# EAGLE design GPIO_Block (EAGLE 6.6.0)

## Sheet 1 of 2
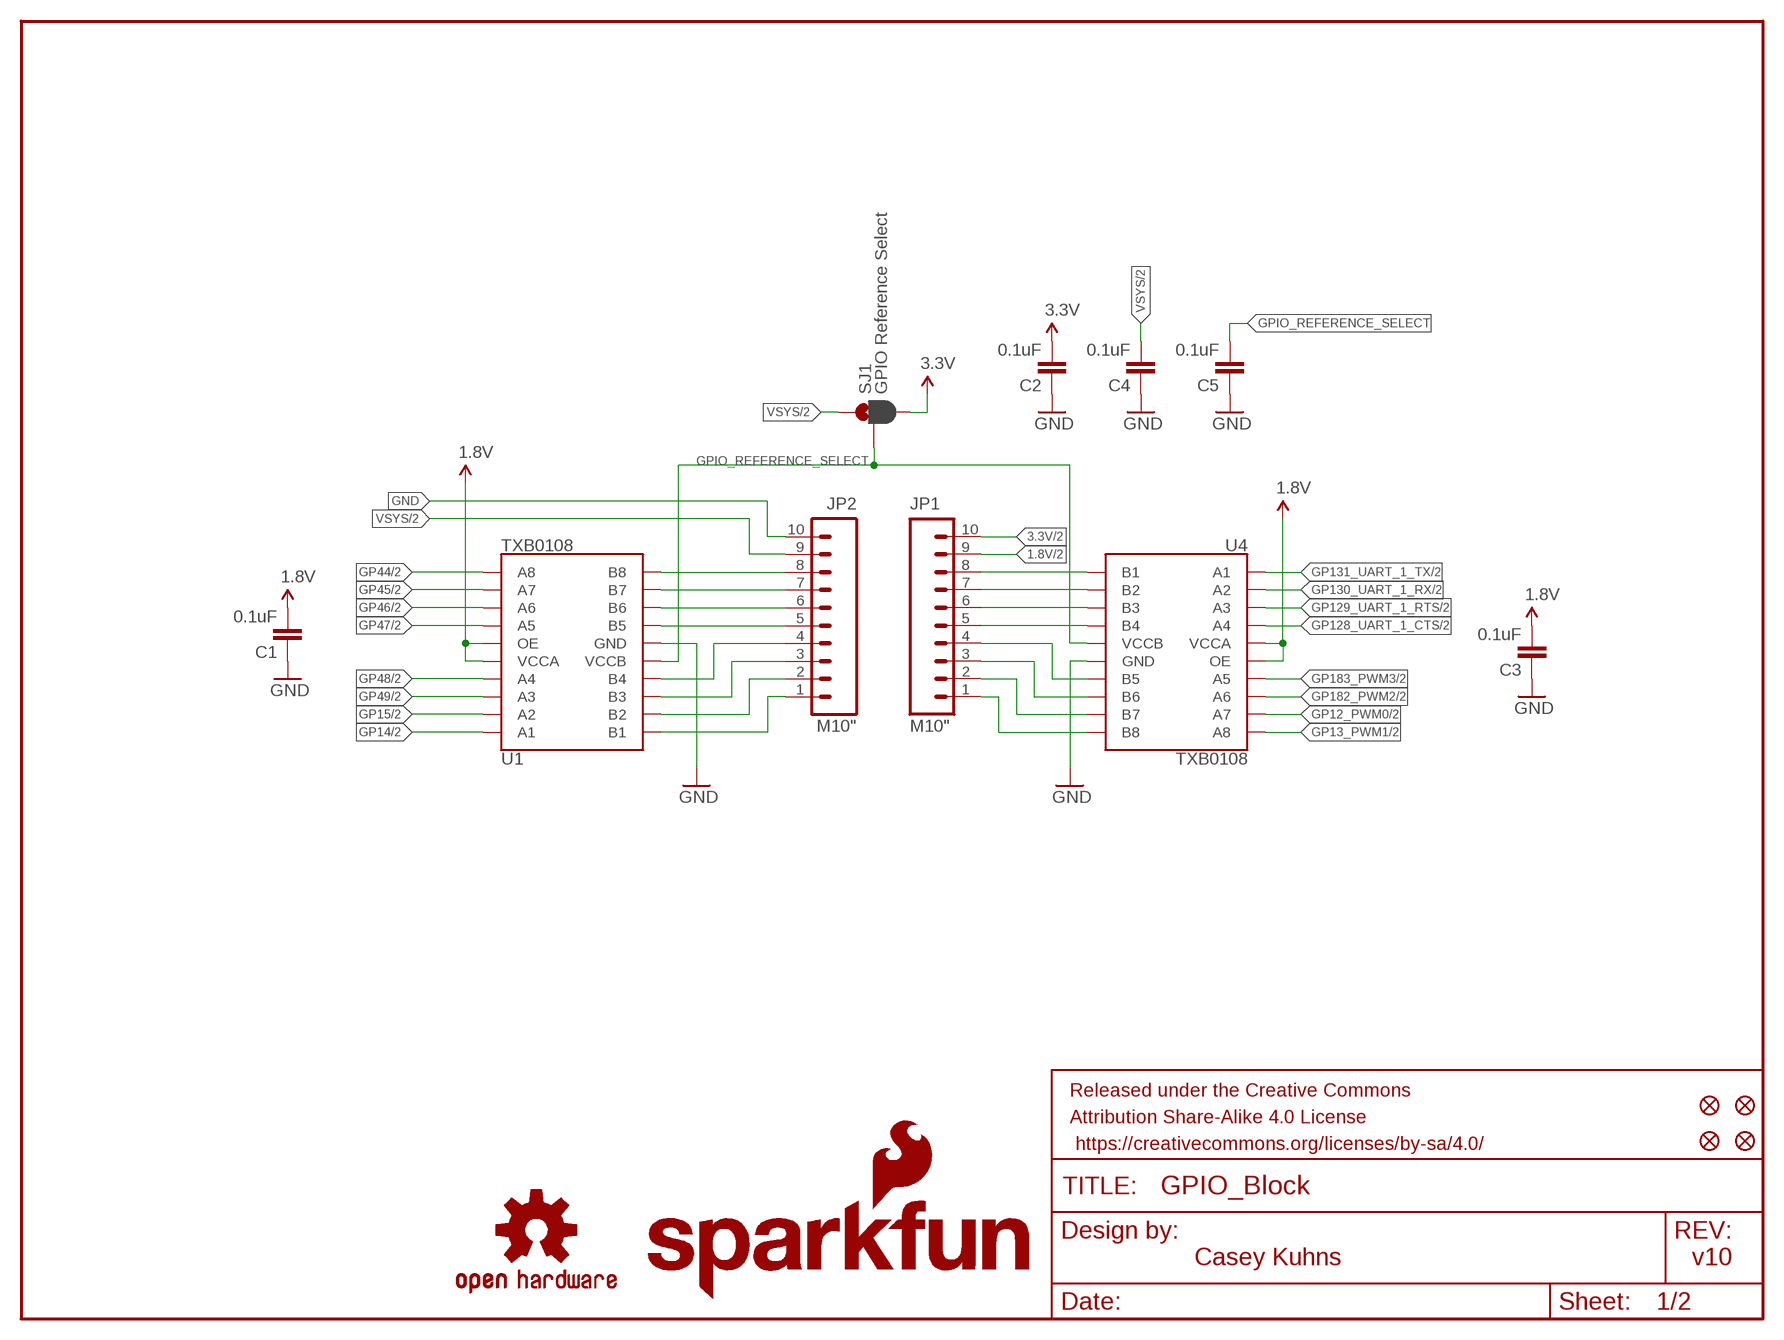
[diagram p0: schematic, sheet 1]

### Parts
C1  0.1uF  0.1UF-25V(+80/-20%)(0603)  [0603-CAP]
C2  0.1uF  0.1UF-25V(+80/-20%)(0603)  [0603-CAP]
C3  0.1uF  0.1UF-25V(+80/-20%)(0603)  [0603-CAP]
C4  0.1uF  0.1UF-25V(+80/-20%)(0603)  [0603-CAP]
C5  0.1uF  0.1UF-25V(+80/-20%)(0603)  [0603-CAP]
FID1  FIDUCIAL1X2  [FIDUCIAL-1X2]
FID2  FIDUCIAL1X2  [FIDUCIAL-1X2]
FID3  FIDUCIAL1X2  [FIDUCIAL-1X2]
FID4  FIDUCIAL1X2  [FIDUCIAL-1X2]
FRAME1  FRAME-LETTER  [CREATIVE_COMMONS]
JP1  M10"  [1X10]
JP2  M10"  [1X10]
LOGO1  OSHW-LOGOS  [OSHW-LOGO-S]
LOGO4  SFE_LOGO_NAME_FLAME.1_INCH  [SFE_LOGO_NAME_FLAME_.1]
SJ1  GPIO Reference Select  JUMPER-PAD-3-2OF3_NC_BY_PASTE  [PAD-JUMPER-3-2OF3_NC_BY_PASTE_YES_SILK_FULL_BOX]
U1  TXB0108  [UFDFN-20]
U4  TXB0108  [UFDFN-20]

### Nets
1.8V: C1.2 C3.2 JP1.9 U1.5(VCCA) U1.6(OE) U4.5(VCCA) U4.6(OE) ; also sheet 2
3.3V: C2.2 JP1.10 SJ1.3 ; also sheet 2
GND: C1.1 C2.1 C3.1 C4.1 C5.1 JP2.10 U1.15(GND) U4.15(GND) ; also sheet 2
GP12_PWM0: U4.9(A7) ; also sheet 2
GP13_PWM1: U4.10(A8) ; also sheet 2
GP14: U1.1(A1) ; also sheet 2
GP15: U1.2(A2) ; also sheet 2
GP44: U1.10(A8) ; also sheet 2
GP45: U1.9(A7) ; also sheet 2
GP46: U1.8(A6) ; also sheet 2
GP47: U1.7(A5) ; also sheet 2
GP48: U1.4(A4) ; also sheet 2
GP49: U1.3(A3) ; also sheet 2
GP128_UART_1_CTS: U4.4(A4) ; also sheet 2
GP129_UART_1_RTS: U4.3(A3) ; also sheet 2
GP130_UART_1_RX: U4.2(A2) ; also sheet 2
GP131_UART_1_TX: U4.1(A1) ; also sheet 2
GP182_PWM2: U4.8(A6) ; also sheet 2
GP183_PWM3: U4.7(A5) ; also sheet 2
GPIO_REFERENCE_SELECT: C5.2 SJ1.2 U1.16(VCCB) U4.16(VCCB)
N$1: JP2.8 U1.11(B8)
N$2: JP2.7 U1.12(B7)
N$3: JP2.6 U1.13(B6)
N$4: JP2.5 U1.14(B5)
N$5: JP2.4 U1.17(B4)
N$6: JP2.3 U1.18(B3)
N$7: JP2.2 U1.19(B2)
N$8: JP2.1 U1.20(B1)
N$11: JP1.4 U4.14(B5)
N$12: JP1.3 U4.13(B6)
N$13: JP1.2 U4.12(B7)
N$14: JP1.1 U4.11(B8)
N$15: JP1.5 U4.17(B4)
N$16: JP1.6 U4.18(B3)
N$17: JP1.7 U4.19(B2)
N$18: JP1.8 U4.20(B1)
VSYS: C4.2 JP2.9 SJ1.1 ; also sheet 2

### Notes on the sheet
- Casey Kuhns | v10

## Sheet 2 of 2
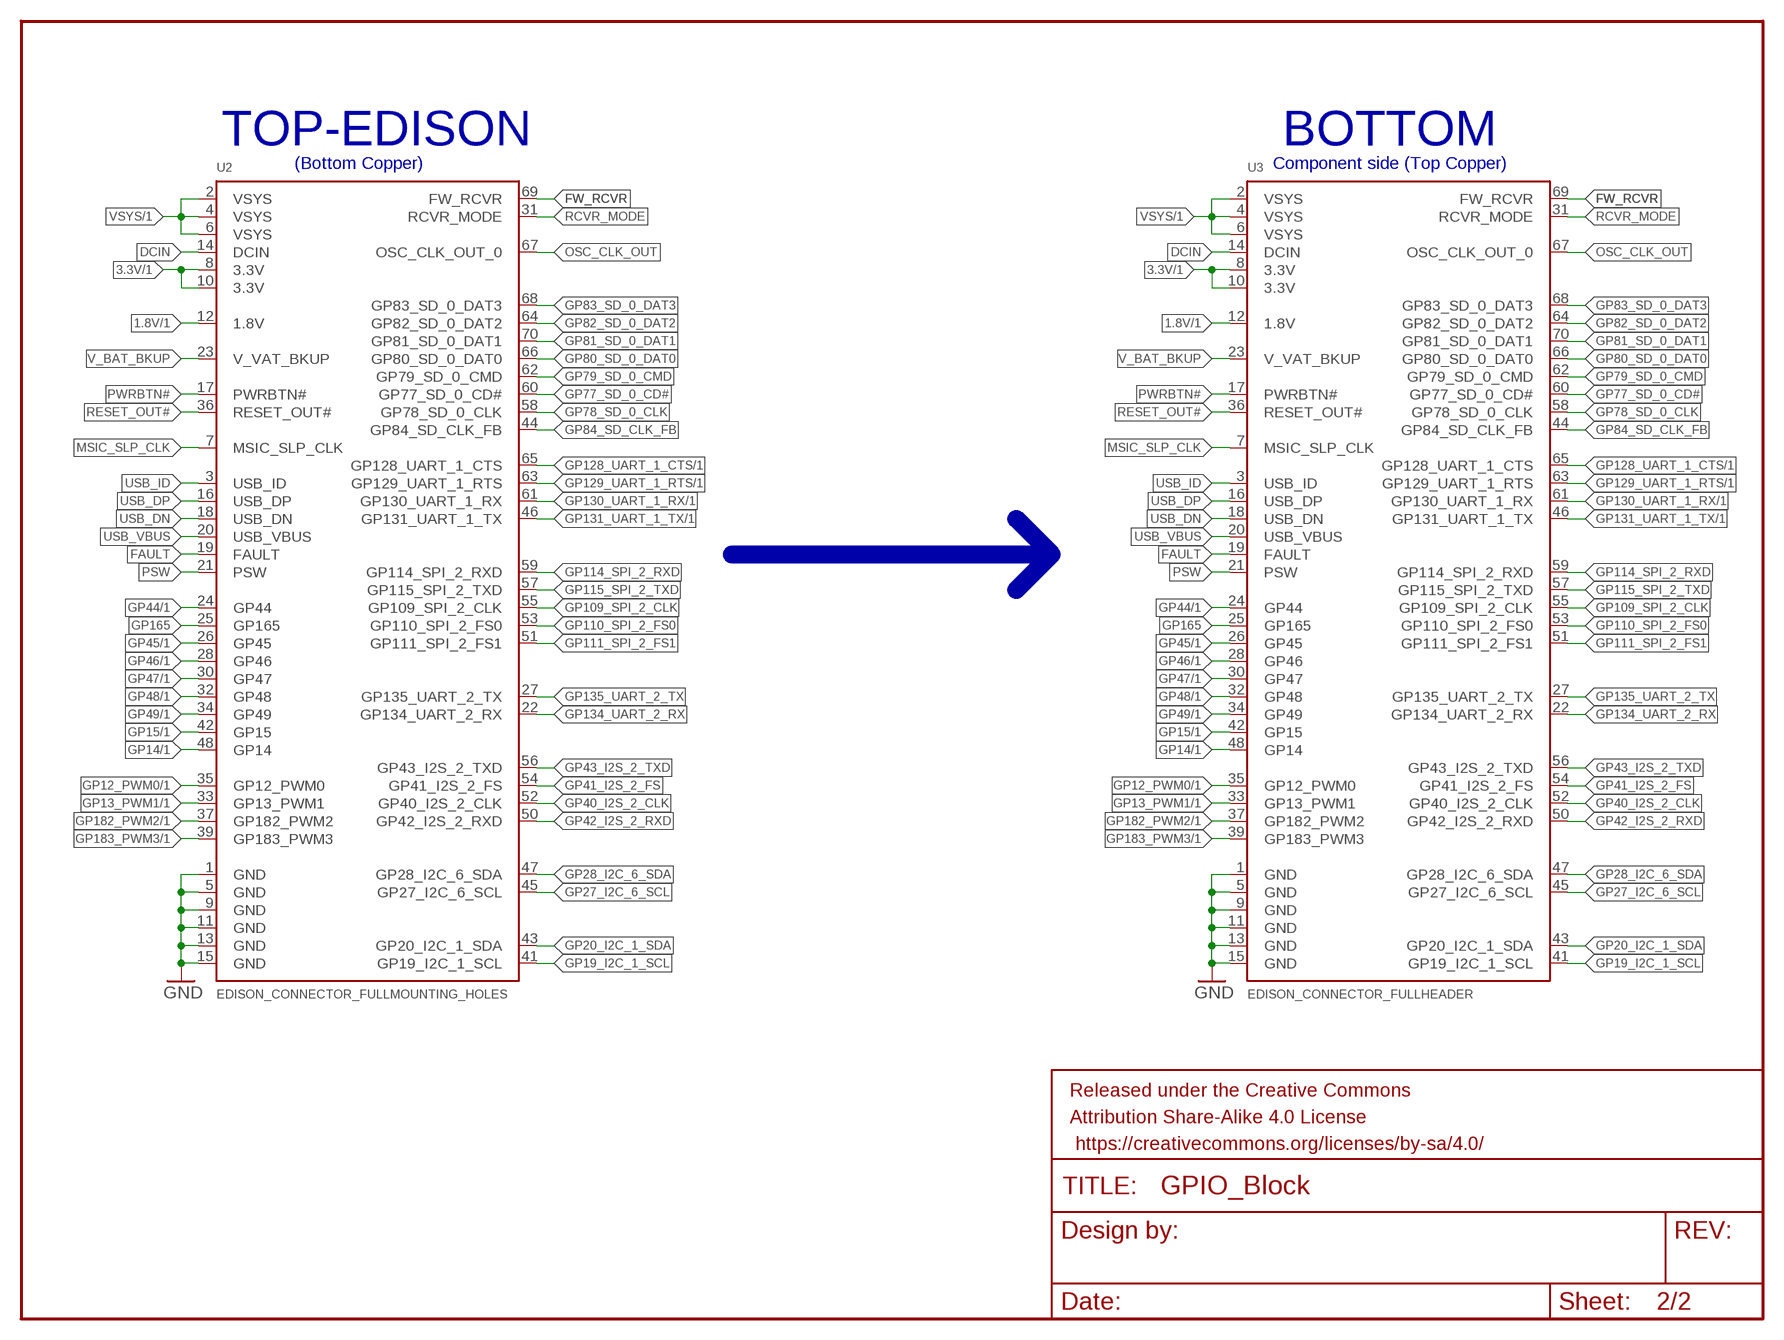
[diagram p1: schematic, sheet 2]

### Parts
FRAME2  FRAME-LETTER  [CREATIVE_COMMONS]
U2  EDISON_CONNECTOR_FULLMOUNTING_HOLES  [EDISON_DAUGHTER]
U3  EDISON_CONNECTOR_FULLHEADER  [DF40C-70DP-0.4(51)]

### Nets
1.8V: U2.12(1.8V) U3.12(1.8V) ; also sheet 1
3.3V: U2.8(3.3V) U2.10(3.3V) U3.8(3.3V) U3.10(3.3V) ; also sheet 1
DCIN: U2.14(DCIN) U3.14(DCIN)
FAULT: U2.19(FAULT) U3.19(FAULT)
FW_RCVR: U2.69(FW_RCVR) U3.69(FW_RCVR)
GND: U2.1(GND) U2.5(GND) U2.9(GND) U2.11(GND) U2.13(GND) U2.15(GND) U3.1(GND) U3.5(GND) U3.9(GND) U3.11(GND) U3.13(GND) U3.15(GND) ; also sheet 1
GP12_PWM0: U2.35(GP12_PWM0) U3.35(GP12_PWM0) ; also sheet 1
GP13_PWM1: U2.33(GP13_PWM1) U3.33(GP13_PWM1) ; also sheet 1
GP14: U2.48(GP14) U3.48(GP14) ; also sheet 1
GP15: U2.42(GP15) U3.42(GP15) ; also sheet 1
GP19_I2C_1_SCL: U2.41(GP19_I2C_1_SCL) U3.41(GP19_I2C_1_SCL)
GP20_I2C_1_SDA: U2.43(GP20_I2C_1_SDA) U3.43(GP20_I2C_1_SDA)
GP27_I2C_6_SCL: U2.45(GP27_I2C_6_SCL) U3.45(GP27_I2C_6_SCL)
GP28_I2C_6_SDA: U2.47(GP28_I2C_6_SDA) U3.47(GP28_I2C_6_SDA)
GP40_I2S_2_CLK: U2.52(GP40_I2S_2_CLK) U3.52(GP40_I2S_2_CLK)
GP41_I2S_2_FS: U2.54(GP41_I2S_2_FS) U3.54(GP41_I2S_2_FS)
GP42_I2S_2_RXD: U2.50(GP42_I2S_2_RXD) U3.50(GP42_I2S_2_RXD)
GP43_I2S_2_TXD: U2.56(GP43_I2S_2_TXD) U3.56(GP43_I2S_2_TXD)
GP44: U2.24(GP44) U3.24(GP44) ; also sheet 1
GP45: U2.26(GP45) U3.26(GP45) ; also sheet 1
GP46: U2.28(GP46) U3.28(GP46) ; also sheet 1
GP47: U2.30(GP47) U3.30(GP47) ; also sheet 1
GP48: U2.32(GP48) U3.32(GP48) ; also sheet 1
GP49: U2.34(GP49) U3.34(GP49) ; also sheet 1
GP77_SD_0_CD#: U2.60(GP77_SD_0_CD#) U3.60(GP77_SD_0_CD#)
GP78_SD_0_CLK: U2.58(GP78_SD_0_CLK) U3.58(GP78_SD_0_CLK)
GP79_SD_0_CMD: U2.62(GP79_SD_0_CMD) U3.62(GP79_SD_0_CMD)
GP80_SD_0_DAT0: U2.66(GP80_SD_0_DAT0) U3.66(GP80_SD_0_DAT0)
GP81_SD_0_DAT1: U2.70(GP81_SD_0_DAT1) U3.70(GP81_SD_0_DAT1)
GP82_SD_0_DAT2: U2.64(GP82_SD_0_DAT2) U3.64(GP82_SD_0_DAT2)
GP83_SD_0_DAT3: U2.68(GP83_SD_0_DAT3) U3.68(GP83_SD_0_DAT3)
GP84_SD_CLK_FB: U2.44(GP84_SD_CLK_FB) U3.44(GP84_SD_CLK_FB)
GP109_SPI_2_CLK: U2.55(GP109_SPI_2_CLK) U3.55(GP109_SPI_2_CLK)
GP110_SPI_2_FS0: U2.53(GP110_SPI_2_FS0) U3.53(GP110_SPI_2_FS0)
GP111_SPI_2_FS1: U2.51(GP111_SPI_2_FS1) U3.51(GP111_SPI_2_FS1)
GP114_SPI_2_RXD: U2.59(GP114_SPI_2_RXD) U3.59(GP114_SPI_2_RXD)
GP115_SPI_2_TXD: U2.57(GP115_SPI_2_TXD) U3.57(GP115_SPI_2_TXD)
GP128_UART_1_CTS: U2.65(GP128_UART_1_CTS) U3.65(GP128_UART_1_CTS) ; also sheet 1
GP129_UART_1_RTS: U2.63(GP129_UART_1_RTS) U3.63(GP129_UART_1_RTS) ; also sheet 1
GP130_UART_1_RX: U2.61(GP130_UART_1_RX) U3.61(GP130_UART_1_RX) ; also sheet 1
GP131_UART_1_TX: U2.46(GP131_UART_1_TX) U3.46(GP131_UART_1_TX) ; also sheet 1
GP134_UART_2_RX: U2.22(GP134_UART_2_RX) U3.22(GP134_UART_2_RX)
GP135_UART_2_TX: U2.27(GP135_UART_2_TX) U3.27(GP135_UART_2_TX)
GP165: U2.25(GP165) U3.25(GP165)
GP182_PWM2: U2.37(GP182_PWM2) U3.37(GP182_PWM2) ; also sheet 1
GP183_PWM3: U2.39(GP183_PWM3) U3.39(GP183_PWM3) ; also sheet 1
MSIC_SLP_CLK: U2.7(MSIC_SLP_CLK) U3.7(MSIC_SLP_CLK)
OSC_CLK_OUT: U2.67(OSC_CLK_OUT_0) U3.67(OSC_CLK_OUT_0)
PSW: U2.21(PSW) U3.21(PSW)
PWRBTN#: U2.17(PWRBTN#) U3.17(PWRBTN#)
RCVR_MODE: U2.31(RCVR_MODE) U3.31(RCVR_MODE)
RESET_OUT#: U2.36(RESET_OUT#) U3.36(RESET_OUT#)
USB_DN: U2.18(USB_DN) U3.18(USB_DN)
USB_DP: U2.16(USB_DP) U3.16(USB_DP)
USB_ID: U2.3(USB_ID) U3.3(USB_ID)
USB_VBUS: U2.20(USB_VBUS) U3.20(USB_VBUS)
V_BAT_BKUP: U2.23(V_VAT_BKUP) U3.23(V_VAT_BKUP)
VSYS: U2.2(VSYS) U2.4(VSYS) U2.6(VSYS) U3.2(VSYS) U3.4(VSYS) U3.6(VSYS) ; also sheet 1

### Buses
B$1

### Notes on the sheet
- TOP-EDISON | BOTTOM
- (Bottom Copper) | Component side (Top Copper)

## Library data of the parts
C1-C5 = SparkFun-Capacitors:0.1UF-25V(+80/-20%)(0603): CAP-00810 Ceramic Standard decoupling cap; PROD_ID: CAP-00810
FID1-FID4 = SparkFun-Aesthetics:FIDUCIAL: Fiducial Alignment Points Various fiducial points for machine vision alignment.
FRAME1 FRAME2 = SparkFun-Aesthetics:FRAME-LETTER: Schematic Frame Standard 8.5x11 US Letter frame
JP1 JP2 = SparkFun-Connectors:M10: Header 10 Standard 10-pin 0.1" header. Use with straight break away headers (SKU : PRT-00116), right angle break away headers (PRT-00553), swiss pins (PRT-00743), machine pins (PRT-00117), and female headers (PRT-00115).
LOGO1 = SparkFun-Aesthetics:OSHW-LOGO: Open Source Hardware Logo This logo indicates the piece of hardware it is found on incorporates a OSHW license and/or adheres to the definition of open source hardware found here: http://freedomdefined.org/OSHW
LOGO4 = SparkFun-Aesthetics:SFE_LOGO_NAME_FLAME: SFE Logo, name and flame This is the SparkFun full logo. The logo on the schematic will always be the same size; the package variant is the height of the flame part of the logo. Default layer for the logo on the board is tSilk.
SJ1 = SparkFun-Passives:JUMPER-PAD-3-2OF3_NC_BY_PASTE
U1 U4 = Testing:TXB0108; PROD_ID: IC-12292
U2 U3 = Edison:EDISON_CONNECTOR_FULL

## Board
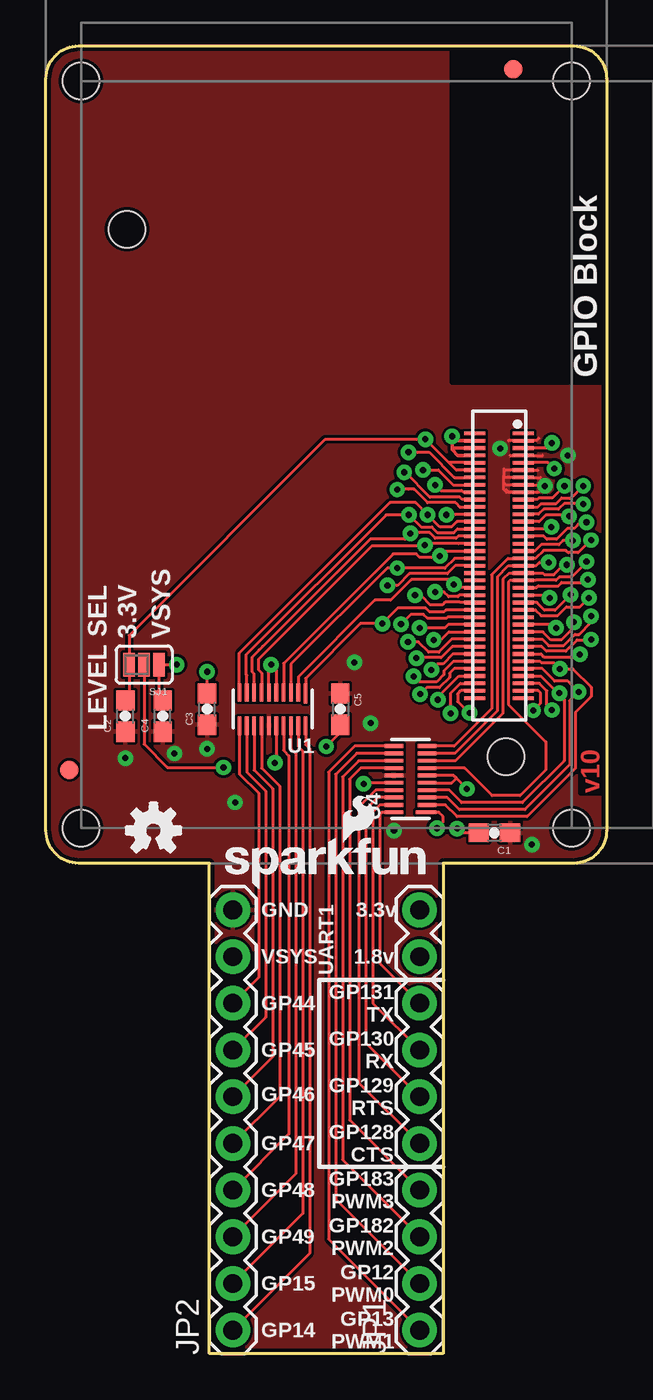
[diagram p2: board, top side]
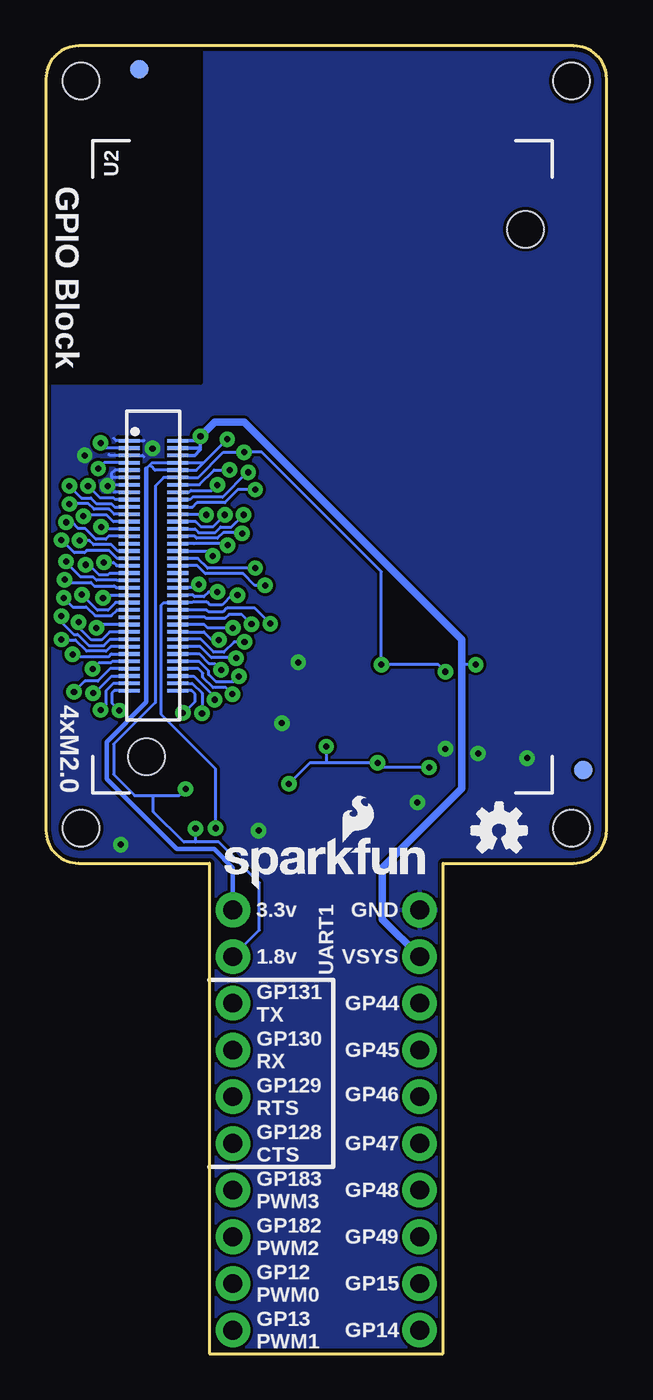
[diagram p3: board, bottom side, seen from below]

Size 30.48 x 71.12 mm. Coordinates in mm from the lower left corner, seen from the top.
Outline: 30.48,69.34 30.48,28.45 arc-90 28.7,26.67 21.59,26.67 21.59,0 8.89,0 8.89,26.67 1.78,26.67 arc-90 0,28.45 0,69.34 arc-90 1.78,71.12 28.7,71.12 arc-90 30.48,69.34
Copper layers (1*16): Top 0.035mm / dielectric 1.5mm / Bottom 0.035mm
Design rules "SparkFun-2-layer *": minimum track width 6mil, minimum drill 13mil, track to track 6mil, track to pad 6mil, pad to pad 6mil, via to via 6mil, smd to smd 6mil, copper to edge 8mil, drill to drill 8mil, minimum pad ring 12mil, minimum via ring 10mil, stop-mask expansion 4mil, vias tented up to drill 20mil, thermal gap 6mil
Holes 2 mm at 28.57,28.58 1.91,28.58 1.91,69.22 28.57,69.22
tRestrict: area 22.1,52.8 to 30.5,71.1
bRestrict: area 22.1,52.8 to 30.5,71.1

### Footprints (pad centres in the part's own frame; a part is rotated, then mirrored left to right if it is on the bottom)
0603-CAP = smd 1.1 x 1: 1 -0.85,0; 2 0.85,0
FIDUCIAL-1X2 = smd 1 x 1: 1 0,0
1X10 = drill 1.016 pad 1.88: 1 0,0; 2 2.54,0; 3 5.08,0; 4 7.62,0; 5 10.16,0; 6 12.7,0; 7 15.24,0; 8 17.78,0; 9 20.32,0; 10 22.86,0
PAD-JUMPER-3-2OF3_NC_BY_PASTE_YES_SILK_FULL_BOX = smd 0.635 x 1.27: 1 -0.813,0; 2 0,0; 3 0.813,0
UFDFN-20 = smd 0.2 x 1.1: 1 -1.8,-0.85 | smd 0.2 x 1: 2 -1.4,-0.9; 3 -1,-0.9; 4 -0.6,-0.9; 5 -0.2,-0.9; 6 0.2,-0.9; 7 0.6,-0.9; 8 1,-0.9; 9 1.4,-0.9; 10 1.8,-0.9; 11 1.8,0.9; 12 1.4,0.9; 13 1,0.9; 14 0.6,0.9; 15 0.2,0.9; 16 -0.2,0.9; 17 -0.6,0.9; 18 -1,0.9; 19 -1.4,0.9; 20 -1.8,0.9
EDISON_DAUGHTER = smd 1.14 x 0.2: 1 1.98,19.17; 2 4.62,19.17; 3 1.98,18.77; 4 4.62,18.77; 5 1.98,18.37; 6 4.62,18.37; 7 1.98,17.97; 8 4.62,17.97; 9 1.98,17.57; 10 4.62,17.57; 11 1.98,17.17; 12 4.62,17.17; 13 1.98,16.77; 14 4.62,16.77; 15 1.98,16.37; 16 4.62,16.37; 17 1.98,15.97; 18 4.62,15.97; 19 1.98,15.57; 20 4.62,15.57; 21 1.98,15.17; 22 4.62,15.17; 23 1.98,14.77; 24 4.62,14.77; 25 1.98,14.37; 26 4.62,14.37; 27 1.98,13.97; 28 4.62,13.97; 29 1.98,13.57; 30 4.62,13.57; 31 1.98,13.17; 32 4.62,13.17; 33 1.98,12.77; 34 4.62,12.77; 35 1.98,12.37; 36 4.62,12.37; 37 1.98,11.97; 38 4.62,11.97; 39 1.98,11.57; 40 4.62,11.57; 41 1.98,11.17; 42 4.62,11.17; 43 1.98,10.77; 44 4.62,10.77; 45 1.98,10.37; 46 4.62,10.37; 47 1.98,9.97; 48 4.62,9.97; 49 1.98,9.57; 50 4.62,9.57; 51 1.98,9.17; 52 4.62,9.17; 53 1.98,8.77; 54 4.62,8.77; 55 1.98,8.37; 56 4.62,8.37; 57 1.98,7.97; 58 4.62,7.97; 59 1.98,7.57; 60 4.62,7.57; 61 1.98,7.17; 62 4.62,7.17; 63 1.98,6.77; 64 4.62,6.77; 65 1.98,6.37; 66 4.62,6.37; 67 1.98,5.97; 68 4.62,5.97; 69 1.98,5.57; 70 4.62,5.57 | hole 2: 23.53,30.67; 2.93,1.98
DF40C-70DP-0.4(51) = smd 0.2 x 1.14 bottom: 1 6.8,1.32; 2 6.8,-1.32; 3 6.4,1.32; 4 6.4,-1.32; 5 6,1.32; 6 6,-1.32; 7 5.6,1.32; 8 5.6,-1.32; 9 5.2,1.32; 10 5.2,-1.32; 11 4.8,1.32; 12 4.8,-1.32; 13 4.4,1.32; 14 4.4,-1.32; 15 4,1.32; 16 4,-1.32; 17 3.6,1.32; 18 3.6,-1.32; 19 3.2,1.32; 20 3.2,-1.32; 21 2.8,1.32; 22 2.8,-1.32; 23 2.4,1.32; 24 2.4,-1.32; 25 2,1.32; 26 2,-1.32; 27 1.6,1.32; 28 1.6,-1.32; 29 1.2,1.32; 30 1.2,-1.32; 31 0.8,1.32; 32 0.8,-1.32; 33 0.4,1.32; 34 0.4,-1.32; 35 0,1.32; 36 0,-1.32; 37 -0.4,1.32; 38 -0.4,-1.32; 39 -0.8,1.32; 40 -0.8,-1.32; 41 -1.2,1.32; 42 -1.2,-1.32; 43 -1.6,1.32; 44 -1.6,-1.32; 45 -2,1.32; 46 -2,-1.32; 47 -2.4,1.32; 48 -2.4,-1.32; 49 -2.8,1.32; 50 -2.8,-1.32; 51 -3.2,1.32; 52 -3.2,-1.32; 53 -3.6,1.32; 54 -3.6,-1.32; 55 -4,1.32; 56 -4,-1.32; 57 -4.4,1.32; 58 -4.4,-1.32; 59 -4.8,1.32; 60 -4.8,-1.32; 61 -5.2,1.32; 62 -5.2,-1.32; 63 -5.6,1.32; 64 -5.6,-1.32; 65 -6,1.32; 66 -6,-1.32; 67 -6.4,1.32; 68 -6.4,-1.32; 69 -6.8,1.32; 70 -6.8,-1.32; NC1 7.2,1.32; NC2 7.2,-1.32; NC3 -7.2,-1.32; NC4 -7.2,1.32

### Placement (x,y rotation side)
C1  24.38,28.32 180 top
C2  4.32,34.67 90 top
C3  8.76,35.05 90 top
C4  6.35,34.67 90 top
C5  16,35.05 270 top
FID1  1.27,31.75 0 top
FID2  25.4,69.85 0 top
FID3  1.27,31.75 0 bottom
FID4  25.4,69.85 0 bottom
FRAME1  -1.27,-7.62 0 top  (outside the outline)
FRAME2  -1.27,-7.62 0 top  (outside the outline)
JP1  20.32,1.27 90 top
JP2  10.16,1.27 90 top
LOGO1  5.84,28.45 0 top
LOGO2  OSHW-LOGOS  [OSHW-LOGO-S]  5.84,28.45 0 bottom
LOGO3  SFE_LOGO_NAME_FLAME.1_INCH  [SFE_LOGO_NAME_FLAME_.1]  21.21,25.15 0 bottom
LOGO4  9.3,25.15 0 top
SJ1  5.33,37.47 180 top
U1  12.32,35.05 180 top
U2  27.94,30.48 0 bottom
U3  24.64,42.85 90 bottom
U4  19.81,31.24 90 top

### Tracks (layer width: path | path; a pad name or v marks a point on that pad's centre or on a via)
1.8V  (via drill 0.33)
  Top 0.152: v22.89,30.71 22.3,31.29 | U4.6 22.15,31.44 22.3,31.29 | U1.5 12.52,37.19 v12.24,37.47 12.12,37.34 U1.6 | C1.2 22.58,28.32 v22.35,28.55 | C3.2 v8.76,37.08 | v19.71,49.02 20.83,49.02 22.2,47.65 U3.12 | 22.3,31.29 22.3,31.27 22.07,31.04 U4.5
  Bottom 0.152: JP1.9 18.87,23.04 18.87,25.6 21.08,27.81 22.35,27.81 | 24.64,30.35 25.65,30.35 26.8,31.5 26.8,33.15 24.54,35.41 24.54,47.19 24.08,47.65 24.05,47.65 U3.12 22.2,47.65 20.83,49.02 v19.71,49.02 18.75,49.02 12.24,42.52 v12.24,37.47 9.14,37.47 v8.76,37.08 | 24.64,30.35 23.24,30.35 v22.89,30.71 | 22.35,27.81 22.99,27.81 24.64,29.46 24.64,30.35 | v22.35,28.55 22.35,27.81
3.3V  (via drill 0.33)
  Top 0.152: C2.2 4.52,35.72 SJ1.3 4.52,39.06 15.19,49.73 v20.62,49.73 21.91,48.45 | 21.91,48.45 22.31,48.05 U3.10 | U3.8 21.91,48.45 | U3.8
  Top 0.254: SJ1.3 4.45,37.54
  Bottom 0.152: v20.62,49.73 21.91,48.45 | U3.10 | U3.10 22.31,48.05 21.91,48.45 | 21.91,48.45 U3.8 24.7,48.45 25.02,48.13 | U3.10 | U3.10 24.55,48.05 24.77,48.26
  Bottom 0.254: JP1.10 20.32,26.42 21.34,27.43 23.37,27.43 27.18,31.24 27.18,33.27 25.02,35.43 25.02,48.01 25.02,48.13
DCIN  (via drill 0.33)
  Top 0.152: v20.5,48.06 21.34,48.06 22.14,47.25 U3.14
  Bottom 0.152: U3.14 22.14,47.25 21.34,48.06 v20.5,48.06
FAULT  (via drill 0.33)
  Top 0.152: U3.19 26.75,46.05 26.92,46.23 27.74,46.23 28.04,46.53 28.55,46.53 v29.21,47.19
  Bottom 0.152: v29.21,47.19 28.55,46.53 28.04,46.53 27.74,46.23 26.92,46.23 26.75,46.05 U3.19
FW_RCVR  (via drill 0.33)
  Top 0.152: v26.49,34.98 26.9,35.38 26.9,35.92 26.76,36.05 U3.69
  Bottom 0.152: U3.69 26.76,36.05 26.9,35.92 26.9,35.38 v26.49,34.98
GND  (via drill 0.33)
  Top 0.152: U3.1 25.15,49.65 25.15,49.66 | 26.8,49.78 26.67,49.66 25.91,49.66 | 25.23,48.85 U3.5 | U3.5 27.01,48.85 | U3.9 24.98,48.05 24.89,48.13 24.89,47.75 | 24.89,47.75 24.99,47.65 U3.11 26.9,47.65 | U3.13 25.01,47.25 24.89,47.37 | 24.89,47.37 24.89,47.75 | U3.15 25.03,46.85 24.89,46.99 24.89,47.37 | U3.9 26.75,48.05 | U3.5 | U3.9 | 26.78,46.85 25.16,46.85 25.02,46.99 | U3.13 25.15,47.25 25.15,47.24 | U3.13 27.17,47.25 27.18,47.24 | U3.13 27.05,47.25 27.05,47.24
  Bottom 0.152: 25.15,49.66 25.15,49.65 U3.1 26.66,49.65 26.8,49.78 | 25.15,48.77 25.23,48.85 U3.5 27.01,48.85 27.05,48.9 | U3.15 26.78,46.85 27.05,47.12 | 27.05,47.12 v27.13,47.19 26.92,47.4 26.92,47.62 | U3.9 26.75,48.05 | 26.75,48.05 26.92,47.88 26.92,47.62 | U3.11 26.9,47.65 26.92,47.62 | 26.92,47.25 27.17,47.25 | U3.13 25.91,47.25 25.91,47.24 25.91,47.25 | 25.61,48.05 26.75,48.05 | 26.75,48.05 | U3.13 26.92,47.25 | 26.92,47.25 27.05,47.12 | U3.13
  other vias: 28.37,48.84 18.92,28.45 26.42,27.69 17.65,34.29 16.76,37.59 8.76,32.89 6.99,32.64 10.29,29.97 24.69,49.23 4.32,32.39
  pour Bottom (isolate 0.152, rank 6): 30.48,69.34 30.48,28.45 arc-90 28.7,26.67 21.59,26.67 21.59,0 8.89,0 8.89,26.67 1.78,26.67 arc-90 0,28.45 0,69.34 arc-90 1.78,71.12 28.7,71.12 arc-90
  pour Top (isolate 0.152, rank 6): 30.48,28.4 arc-90 28.75,26.67 21.59,26.67 21.59,0 8.89,0 8.89,26.67 1.78,26.67 arc-90 0,28.45 0,69.34 arc-90 1.78,71.12 28.7,71.12 arc-90 30.48,69.34
GP12_PWM0  (via drill 0.33)
  Top 0.152: v27.33,43.03 26.82,43.03 26.64,42.85 U3.35 25.15,42.85 24.54,42.24 24.54,34.95 22.23,32.64 U4.9
  Bottom 0.152: v27.33,43.03 26.82,43.03 26.64,42.85 U3.35 | U3.35
GP13_PWM1  (via drill 0.33)
  Top 0.152: v29.64,44.25 29.62,44.25 28.93,43.56 28.4,43.56 28.27,43.69 27.05,43.69 26.61,43.25 U3.33 25.11,43.25 24.23,42.37 24.23,35.08 22.2,33.04 U4.10
  Bottom 0.152: U3.33 26.61,43.25 27.05,43.69 28.27,43.69 28.4,43.56 28.93,43.56 29.62,44.25 v29.64,44.25
GP14  (via drill 0.33)
  Top 0.152: U3.48 23.31,40.44 21.74,40.44 21.64,40.34 20.85,40.34 20.65,40.54 19.13,40.54 v18.29,39.7 17.09,39.7 14.12,36.73 U1.1
  Bottom 0.152: v18.29,39.7 19.13,40.54 20.65,40.54 20.85,40.34 21.64,40.34 21.74,40.44 23.31,40.44 arc90 U3.48
GP15  (via drill 0.33)
  Top 0.152: U3.42 22.36,41.65 v22.17,41.83 21.92,42.09 19.86,42.09 18.75,40.97 17.88,40.97 13.72,36.81 U1.2
  Bottom 0.152: v22.17,41.83 22.36,41.65 U3.42
GP19_I2C_1_SCL  (via drill 0.33)
  Top 0.152: U3.41 26.66,41.65 26.77,41.76 27.86,41.76 28.04,41.94 29.31,41.94 v29.46,42.09
  Bottom 0.152: v29.46,42.09 29.31,41.94 28.04,41.94 27.86,41.76 26.77,41.76 26.66,41.65 U3.41
GP20_I2C_1_SDA  (via drill 0.33)
  Top 0.152: U3.43 27.23,41.25 v27.38,41.1
  Bottom 0.152: v27.38,41.1 27.23,41.25 U3.43 | U3.43
GP27_I2C_6_SCL  (via drill 0.33)
  Top 0.152: v28.52,41.28 27.69,40.44 27.1,40.44 26.69,40.85 U3.45
  Bottom 0.152: U3.45 26.69,40.85 27.1,40.44 27.69,40.44 v28.52,41.28
GP28_I2C_6_SDA  (via drill 0.33)
  Top 0.152: U3.47 26.61,40.45 26.92,40.13 27.81,40.13 28.3,40.62 29.03,40.62 v29.52,41.1
  Bottom 0.152: v29.52,41.1 29.03,40.62 28.3,40.62 27.81,40.13 26.92,40.13 26.61,40.45 U3.47
GP40_I2S_2_CLK  (via drill 0.33)
  Top 0.152: U3.52 21.87,39.65 21.69,39.47 v20.32,39.47
  Bottom 0.152: v20.32,39.47 21.69,39.47 21.87,39.65 U3.52
GP41_I2S_2_FS  (via drill 0.33)
  Top 0.152: v21.08,38.81 21.46,38.81 21.9,39.25 U3.54
  Bottom 0.152: U3.54 21.9,39.25 21.46,38.81 v21.08,38.81
GP42_I2S_2_RXD  (via drill 0.33)
  Top 0.152: U3.50 21.84,40.05 21.77,39.98 20.75,39.98 20.52,40.21 19.84,40.21 v19.3,39.68
  Bottom 0.152: U3.50 21.84,40.05 21.77,39.98 20.75,39.98 20.52,40.21 19.84,40.21 v19.3,39.68
GP43_I2S_2_TXD  (via drill 0.33)
  Top 0.152: U3.56 22.06,38.85 21.36,38.15 20.8,38.15 20.24,38.71 v19.68,38.71
  Bottom 0.152: v19.68,38.71 20.24,38.71 20.8,38.15 21.36,38.15 22.06,38.85 U3.56
GP44  (via drill 0.33)
  Top 0.152: U3.24 22.34,45.25 22.05,44.96 21.41,44.96 v20.75,45.62 20.09,46.28 18.69,46.28 10.52,38.1 U1.10
  Bottom 0.152: v20.75,45.62 21.41,44.96 22.05,44.96 22.34,45.25 U3.24
GP45  (via drill 0.33)
  Top 0.152: U3.26 22.37,44.85 22.17,44.65 21.29,44.65 20.98,44.96 20.4,44.96 v19.74,45.62 18.49,45.62 10.9,38.02 10.9,36.91 10.92,36.88 U1.9
  Bottom 0.152: U3.26 22.37,44.85 22.17,44.65 21.29,44.65 20.98,44.96 20.4,44.96 v19.74,45.62
GP46  (via drill 0.33)
  Top 0.152: U3.28 22.4,44.45 22.3,44.35 21.16,44.35 20.85,44.65 19.86,44.65 v19.81,44.6 19.51,44.3 17.63,44.3 11.79,38.46 11.6,38.27 11.23,37.9 11.23,37.06 11.32,36.97 U1.8
  Bottom 0.152: v19.81,44.6 19.86,44.65 20.85,44.65 21.16,44.35 22.3,44.35 22.4,44.45 U3.28
GP47  (via drill 0.33)
  Top 0.152: U3.30 22.43,44.05 22.43,44.04 20.68,44.04 v20.6,43.97 20.55,43.92 17.7,43.92 11.96,38.18 11.91,38.12 11.56,37.77 11.56,37.19 11.72,37.02 U1.7
  Bottom 0.152: v20.6,43.97 20.68,44.04 22.43,44.04 22.43,44.05 U3.30
GP48  (via drill 0.33)
  Top 0.152: U3.32 21.68,43.65 v21.41,43.38 21.34,43.31 20.32,43.31 20.14,43.48 18.87,43.48 12.92,37.53 U1.4
  Bottom 0.152: U3.32 21.68,43.65 v21.41,43.38
GP49  (via drill 0.33)
  Top 0.152: U3.34 22.22,43.25 21.69,42.72 v19.1,42.72 18.54,42.72 13.32,37.5 U1.3
  Bottom 0.152: U3.34 22.22,43.25 21.69,42.72 v19.1,42.72
GP77_SD_0_CD#  (via drill 0.33)
  Top 0.152: U3.60 22.12,38.05 21.59,37.52 21.29,37.52 v20.95,37.19
  Bottom 0.152: v20.95,37.19 21.29,37.52 21.59,37.52 22.12,38.05 U3.60
GP78_SD_0_CLK  (via drill 0.33)
  Top 0.152: U3.58 22.09,38.45 21.49,37.85 20.17,37.85 v20.14,37.82
  Bottom 0.152: v20.14,37.82 20.17,37.85 21.49,37.85 22.09,38.45 U3.58
GP79_SD_0_CMD  (via drill 0.33)
  Top 0.152: U3.62 22.16,37.65 21.64,37.14 21.64,36.93 21.23,36.53 20.3,36.53 v19.99,36.83
  Bottom 0.152: v19.99,36.83 20.3,36.53 21.23,36.53 21.64,36.93 21.64,37.14 22.16,37.65 U3.62
GP80_SD_0_DAT0  (via drill 0.33)
  Top 0.152: v21.31,35.56 21.31,35.71 22.45,36.85 U3.66
  Bottom 0.152: U3.66 22.45,36.85 21.31,35.71 v21.31,35.56
GP81_SD_0_DAT1  (via drill 0.33)
  Top 0.152: U3.70 22.56,36.05 22.38,35.87 22.38,35.46 22.99,34.85 v23.04,34.85
  Bottom 0.152: v23.04,34.85 22.99,34.85 22.38,35.46 22.38,35.87 22.56,36.05 U3.70
GP82_SD_0_DAT2  (via drill 0.33)
  Top 0.152: U3.64 22.19,37.25 21.95,37.01 21.95,36.78 21.39,36.22 20.7,36.22 v20.34,35.87
  Bottom 0.152: v20.34,35.87 20.7,36.22 21.39,36.22 21.95,36.78 21.95,37.01 22.19,37.25 U3.64
GP83_SD_0_DAT3  (via drill 0.33)
  Top 0.152: v22,34.82 22,35.92 22.53,36.45 U3.68
  Bottom 0.152: U3.68 22.53,36.45 22,35.92 v22,34.82
GP84_SD_CLK_FB  (via drill 0.33)
  Top 0.152: U3.44 22.48,41.25 22.4,41.17 21.89,41.17 21.64,41.43 v21.16,41.43
  Bottom 0.152: v21.16,41.43 21.64,41.43 21.89,41.17 22.4,41.17 22.48,41.25 U3.44 | U3.44
GP109_SPI_2_CLK  (via drill 0.33)
  Top 0.152: U3.55 26.99,38.85 27.33,38.51 28.14,38.51 28.75,39.12 28.98,39.12 29.64,39.78 v29.64,40.11
  Bottom 0.152: v29.64,40.11 29.64,39.78 28.98,39.12 28.75,39.12 28.14,38.51 27.33,38.51 26.99,38.85 U3.55
GP110_SPI_2_FS0  (via drill 0.33)
  Top 0.152: v28.7,39.78 28.7,39.5 28.02,38.81 27.46,38.81 27.02,39.25 U3.53
  Bottom 0.152: U3.53 27.02,39.25 27.46,38.81 28.02,38.81 28.7,39.5 v28.7,39.78
GP111_SPI_2_FS1  (via drill 0.33)
  Top 0.152: v27.74,39.47 27.56,39.65 U3.51
  Bottom 0.152: U3.51 27.56,39.65 v27.74,39.47
GP114_SPI_2_RXD  (via drill 0.33)
  Top 0.152: U3.59 26.92,38.05 27.08,37.9 28.91,37.9 v29.03,38.02
  Bottom 0.152: U3.59 26.92,38.05 27.08,37.9 28.91,37.9 v29.03,38.02
GP115_SPI_2_TXD  (via drill 0.33)
  Top 0.152: U3.57 26.95,38.45 27.2,38.2 28.27,38.2 28.88,38.81 29.62,38.81 v29.64,38.84
  Bottom 0.152: U3.57 26.95,38.45 27.2,38.2 28.27,38.2 28.88,38.81 29.62,38.81 v29.64,38.84
GP128_UART_1_CTS  (via drill 0.33)
  Top 0.152: U3.65 26.9,36.85 27.84,35.92 | 27.84,35.92 v27.91,35.92 | 27.84,35.92 28.17,35.59 28.17,32.23 25.91,29.97 22.61,29.97 21.94,30.64 U4.4
  Bottom 0.152: v27.91,35.92 27.84,35.92 26.9,36.85 U3.65
GP129_UART_1_RTS  (via drill 0.33)
  Top 0.152: U3.63 26.99,37.25 27.66,36.58 28.37,36.58 v28.96,35.99 28.47,35.51 28.47,32.03 26.04,29.59 22.48,29.59 21.83,30.24 U4.3
  Bottom 0.152: U3.63 26.99,37.25 27.66,36.58 28.37,36.58 v28.96,35.99
GP130_UART_1_RX  (via drill 0.33)
  Top 0.152: U3.61 26.87,37.65 26.95,37.57 27.61,37.57 v27.94,37.24 28.65,37.24 29.64,36.25 29.64,35.74 28.78,34.87 28.78,31.83 26.16,29.21 22.35,29.21 21.72,29.84 U4.2
  Bottom 0.152: U3.61 26.87,37.65 26.95,37.57 27.61,37.57 v27.94,37.24
GP131_UART_1_TX  (via drill 0.33)
  Top 0.152: U3.46 22.52,40.85 22.5,40.87 21.72,40.87 21.57,40.72 20.9,40.72 20.37,41.25 v20.07,41.25 | U4.1 21.36,29.44 21.59,29.21 21.59,28.91 v21.26,28.58
  Bottom 0.152: v20.07,41.25 20.37,41.25 20.9,40.72 21.57,40.72 21.72,40.87 22.5,40.87 22.52,40.85 U3.46 24.08,40.84 24.23,40.69 24.23,34.77 21.26,31.8 v21.26,28.58
GP134_UART_2_RX  (via drill 0.33)
  Top 0.152: v21.77,45.62 21.8,45.65 U3.22
  Bottom 0.152: U3.22 21.8,45.65 v21.77,45.62
GP135_UART_2_TX  (via drill 0.33)
  Top 0.152: v29.39,45.21 29.06,45.21 28.73,44.88 28.35,44.88 27.76,44.3 27.23,44.3 27.08,44.45 U3.27
  Bottom 0.152: U3.27 27.08,44.45 27.23,44.3 27.76,44.3 28.35,44.88 28.73,44.88 29.06,45.21 v29.39,45.21
GP165  (via drill 0.33)
  Top 0.152: v27.48,44.96 27.38,44.85 U3.25
  Bottom 0.152: U3.25 27.38,44.85 v27.48,44.96
GP182_PWM2  (via drill 0.33)
  Top 0.152: v28.32,42.9 28.14,42.9 27.61,42.37 27.1,42.37 27.02,42.45 U3.37 25.18,42.45 24.84,42.11 24.84,34.82 22.26,32.24 U4.8
  Bottom 0.152: v28.32,42.9 28.14,42.9 27.61,42.37 27.1,42.37 27.02,42.45 U3.37
GP183_PWM3  (via drill 0.33)
  Top 0.152: v29.39,43.08 29.39,43.03 28.6,42.24 27.91,42.24 27.74,42.06 26.62,42.06 26.61,42.05 U3.39 25.96,42.06 25.25,42.06 25.15,41.96 25.15,35.31 27.18,33.27 27.18,31.75 25.78,30.35 24.26,30.35 22.77,31.84 U4.7
  Bottom 0.152: U3.39 26.61,42.05 26.62,42.06 27.74,42.06 27.91,42.24 28.6,42.24 29.39,43.03 v29.39,43.08
GPIO_REFERENCE_SELECT  (via drill 0.33)
  Top 0.152: U4.16 17.33,31.04 v17.27,30.99 | U1.16 12.52,32.2 v12.45,32.13 | SJ1.2 5.33,33.15 6.6,31.88 v9.65,31.88 | C5.2 16,33.78 v15.24,33.02
  Bottom 0.152: 15.24,32.13 v12.45,32.13 12.19,31.88 v9.65,31.88 | 15.24,32.13 16.13,32.13 v17.27,30.99 | v15.24,33.02 15.24,32.13
MSIC_SLP_CLK  (via drill 0.33)
  Top 0.152: v27.64,48.13 27.32,48.45 U3.7
  Bottom 0.152: U3.7 27.32,48.45 v27.64,48.13
N$1
  Top 0.152: U1.11 10.52,31.52 11.56,30.48 11.56,20.45 JP2.8
N$2
  Top 0.152: U1.12 10.92,31.63 11.94,30.61 11.94,18.29 JP2.7
N$3
  Top 0.152: U1.13 11.32,31.73 12.32,30.73 12.32,16.13 JP2.6
N$4
  Top 0.152: U1.14 11.72,31.84 12.7,30.86 12.7,13.97 JP2.5
N$5
  Top 0.152: U1.17 12.92,32.8 13.21,32.51 13.21,11.94 JP2.4
N$6
  Top 0.152: U1.18 13.32,32.91 13.59,32.64 13.59,9.78 JP2.3
N$7
  Top 0.152: U1.19 13.72,33.02 13.97,32.77 13.97,7.62 JP2.2
N$8
  Top 0.152: U1.20 14.12,33.12 14.35,32.89 14.35,5.46 JP2.1
N$11
  Top 0.152: U4.14 17.11,31.84 16.51,31.24 16.51,12.7 JP1.4
N$12
  Top 0.152: U4.13 17,32.24 16.13,31.37 16.13,10.54 JP1.3
N$13
  Top 0.152: U4.12 16.89,32.64 15.75,31.5 15.75,8.38 JP1.2
N$14
  Top 0.152: U4.11 16.79,33.04 15.37,31.62 15.37,6.22 JP1.1
N$15
  Top 0.152: U4.17 17.94,30.64 17.02,29.72 17.02,14.73 JP1.5
N$16
  Top 0.152: U4.18 18.05,30.24 17.4,29.59 17.4,16.89 JP1.6
N$17
  Top 0.152: U4.19 18.16,29.84 17.78,29.46 17.78,19.05 JP1.7
N$18
  Top 0.152: U4.20 18.27,29.44 18.16,29.34 18.16,21.21 JP1.8
OSC_CLK_OUT  (via drill 0.33)
  Top 0.152: v27.51,35 27.23,35.28 27.23,36.04 26.82,36.45 U3.67
  Bottom 0.152: U3.67 26.82,36.45 27.23,36.04 27.23,35.28 v27.51,35
PSW  (via drill 0.33)
  Top 0.152: v29.21,46.2 29.18,46.23 28.17,46.23 27.86,45.92 27.05,45.92 26.78,45.65 U3.21
  Bottom 0.152: U3.21 26.78,45.65 27.05,45.92 27.86,45.92 28.17,46.23 29.18,46.23 v29.21,46.2
PWRBTN#  (via drill 0.33)
  Top 0.152: v28.19,47.19 27.53,46.53 26.8,46.53 26.71,46.45 U3.17
  Bottom 0.152: U3.17 26.71,46.45 26.8,46.53 27.53,46.53 v28.19,47.19
RCVR_MODE  (via drill 0.33)
  Top 0.152: v28.65,44.22 28.12,44.22 27.89,43.99 26.92,43.99 26.58,43.65 U3.31
  Bottom 0.152: U3.31 26.58,43.65 26.92,43.99 27.89,43.99 28.12,44.22 v28.65,44.22
RESET_OUT#  (via drill 0.33)
  Top 0.152: U3.36 22.25,42.85 21.82,42.42 19.76,42.42 19.13,41.78 v18.57,41.78
  Bottom 0.152: U3.36 22.25,42.85 21.82,42.42 19.76,42.42 19.13,41.78 v18.57,41.78
USB_DN  (via drill 0.33)
  Top 0.152: U3.18 22.64,46.45 22.5,46.58 20.88,46.58 19.53,47.93 v19.48,47.93
  Bottom 0.152: U3.18 22.64,46.45 22.5,46.58 20.88,46.58 19.53,47.93 v19.48,47.93
USB_DP  (via drill 0.33)
  Top 0.152: v21.16,47.24 21.46,46.94 22.61,46.94 22.7,46.85 U3.16
  Bottom 0.152: v21.16,47.24 21.46,46.94 22.61,46.94 22.7,46.85 U3.16
USB_ID  (via drill 0.33)
  Top 0.152: v27.51,49.53 27.23,49.25 U3.3
  Bottom 0.152: U3.3 27.23,49.25 v27.51,49.53
USB_VBUS  (via drill 0.33)
  Top 0.152: U3.20 22.5,46.05 22.28,46.28 20.75,46.28 20.02,47.02 19.71,47.02 19.13,47.02 v19.1,46.99
  Bottom 0.152: U3.20 22.5,46.05 22.28,46.28 20.75,46.28 20.02,47.02 19.13,47.02 v19.1,46.99
V_BAT_BKUP  (via drill 0.33)
  Top 0.152: v28.45,45.54 28.37,45.62 27.18,45.62 26.81,45.25 U3.23
  Bottom 0.152: U3.23 26.81,45.25 27.18,45.62 28.37,45.62 v28.45,45.54
VSYS  (via drill 0.33)
  Top 0.152: C4.2 6.15,35.72 SJ1.1 v7.11,37.47
  Top 0.178: U3.6 22.4,48.85 22.08,49.17 22.08,49.28 | 22.08,49.28 v22.08,49.89 | U3.4 22.11,49.25 22.08,49.28
  Top 0.203: v22.08,49.89 22.32,49.65 U3.2
  Bottom 0.152: v7.11,37.47 7.87,37.47
  Bottom 0.178: U3.6 22.4,48.85 22.08,49.17 22.08,49.28 | v22.08,49.89 22.08,49.28 | U3.4 22.11,49.25 22.08,49.28
  Bottom 0.203: v22.08,49.89 22.32,49.65 U3.2
  Bottom 0.406: JP2.9 12.19,23.62 12.19,26.42 7.87,30.73 7.87,37.47 7.87,38.84 19.71,50.67 21.29,50.67 v22.08,49.89

### Text on the board
Top: v10
tPlace: GPIO Block | 3.3V | VSYS | LEVEL SEL | GND | 3.3v | VSYS | 1.8v | UART1 | GP44 | GP131 / TX | GP45 | GP130 / RX | GP46 | GP129 / RTS | GP47 | GP128 / CTS | GP48 | GP183 / PWM3 | GP49 | GP182 / PWM2 | GP15 | GP12 / PWM0 | GP14 | GP13 / PWM1
bPlace: GPIO Block | 4xM2.0 | GND | 3.3v | VSYS | 1.8v | UART1 | GP44 | GP131 / TX | GP45 | GP130 / RX | GP46 | GP129 / RTS | GP47 | GP128 / CTS | GP48 | GP183 / PWM3 | GP49 | GP182 / PWM2 | GP15 | GP12 / PWM0 | GP14 | GP13 / PWM1
tDocu: NOTE: Units are in Inches | Casey Kuhns